# Altium schematic sheet 12V_PCM.SchDoc
size A4
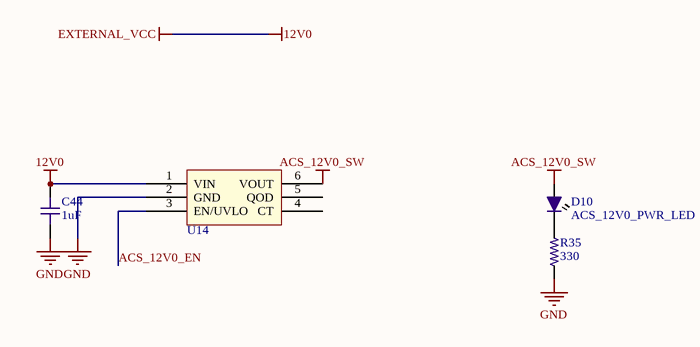
[diagram p0: 12V_PCM.SchDoc]

## Parts
C44  value 1uF  [C0603-IPC]  (hidden comment: Capacitor)
D10  ACS_12V0_PWR_LED  [LED0603-IPC]
R35  value 330  [R0603-IPC]  (hidden comment: 0603 Template)
U14  One Channel Load Switch  [TPS22810-Q1]  (value not drawn)

## Nets
12V0: C44.2 U14.1(VIN)  [also labelled EXTERNAL_VCC]
ACS_12V0_SW: D10.A U14.6(VOUT)
GND: C44.1 R35.2 U14.2(GND)
ACS_12V0_EN: U14.3(EN/UVLO)
NetD10_K: D10.K R35.1

Not connected (* = marked no-connect by the designer): U14 4(CT) 5(QOD)

## Library data of the parts
C44 = 13: Capacitor (0603); OrbitPartId: 13; EIA Code: X5R; Max. Voltage: 16V; Type: Passive; PartId: 1; Subtype: Capacitor
D10 = LED 0603 SMD: Red PWR_LED; Supplier 1: Digi-Key; Supplier Part Number 1: 732-4966-1-ND
R35 = 0603 Template: Chip Resistor, 0603, 51hms, 0.1W
U14 = TPS22810-Q1: 2.7 - 18V @ 2A Max